# EAGLE schematic AMR3350 (EAGLE 9.3.0)
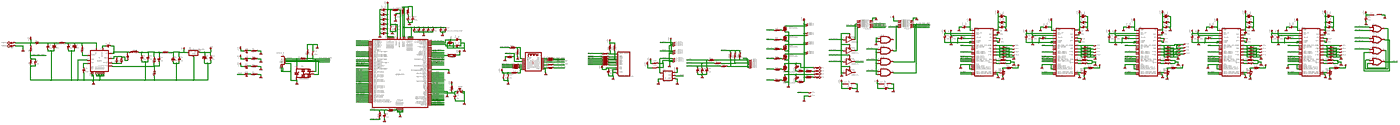
[diagram p0: schematic, sheet 1, overview]
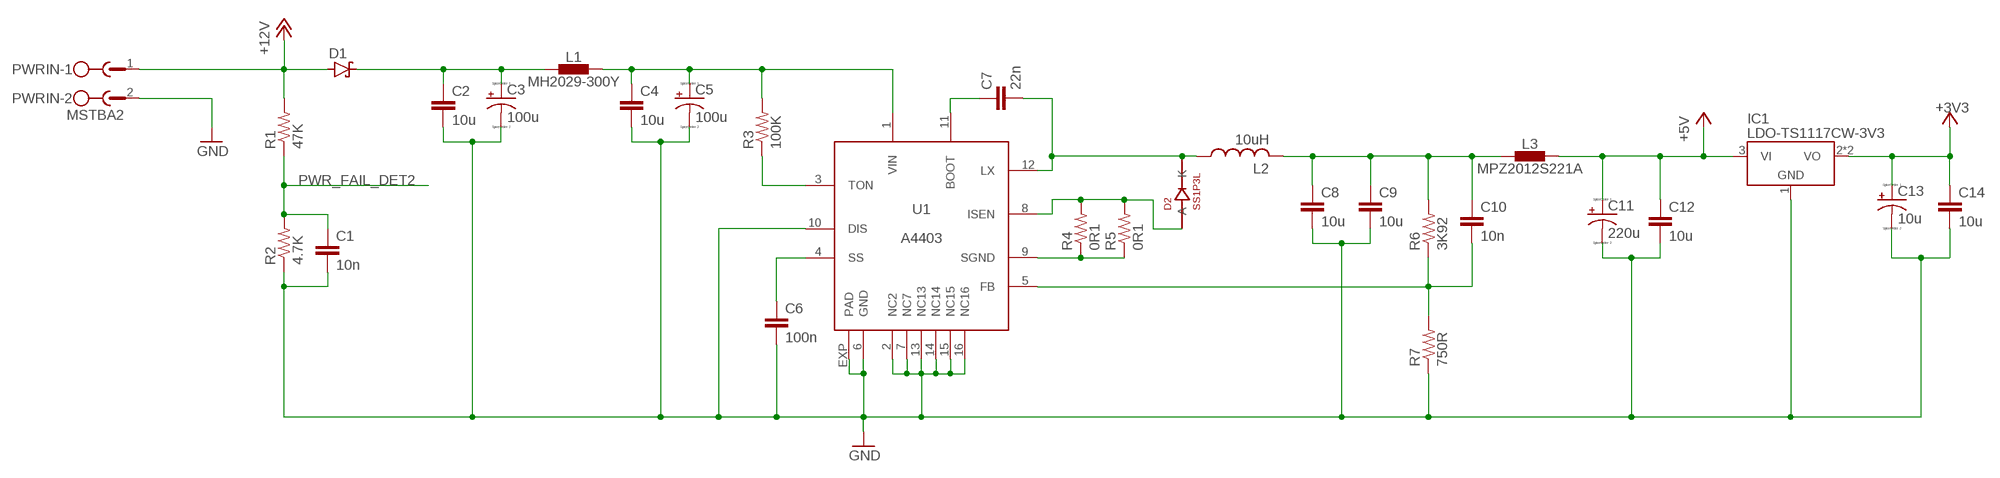
[diagram p1: schematic, sheet 1, part 1 of 8]
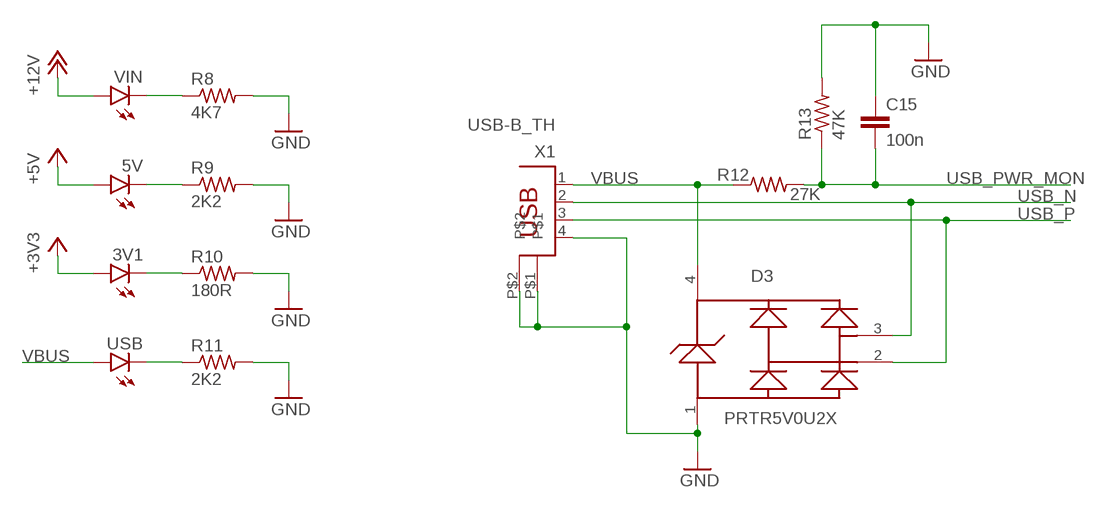
[diagram p2: schematic, sheet 1, part 2 of 8]
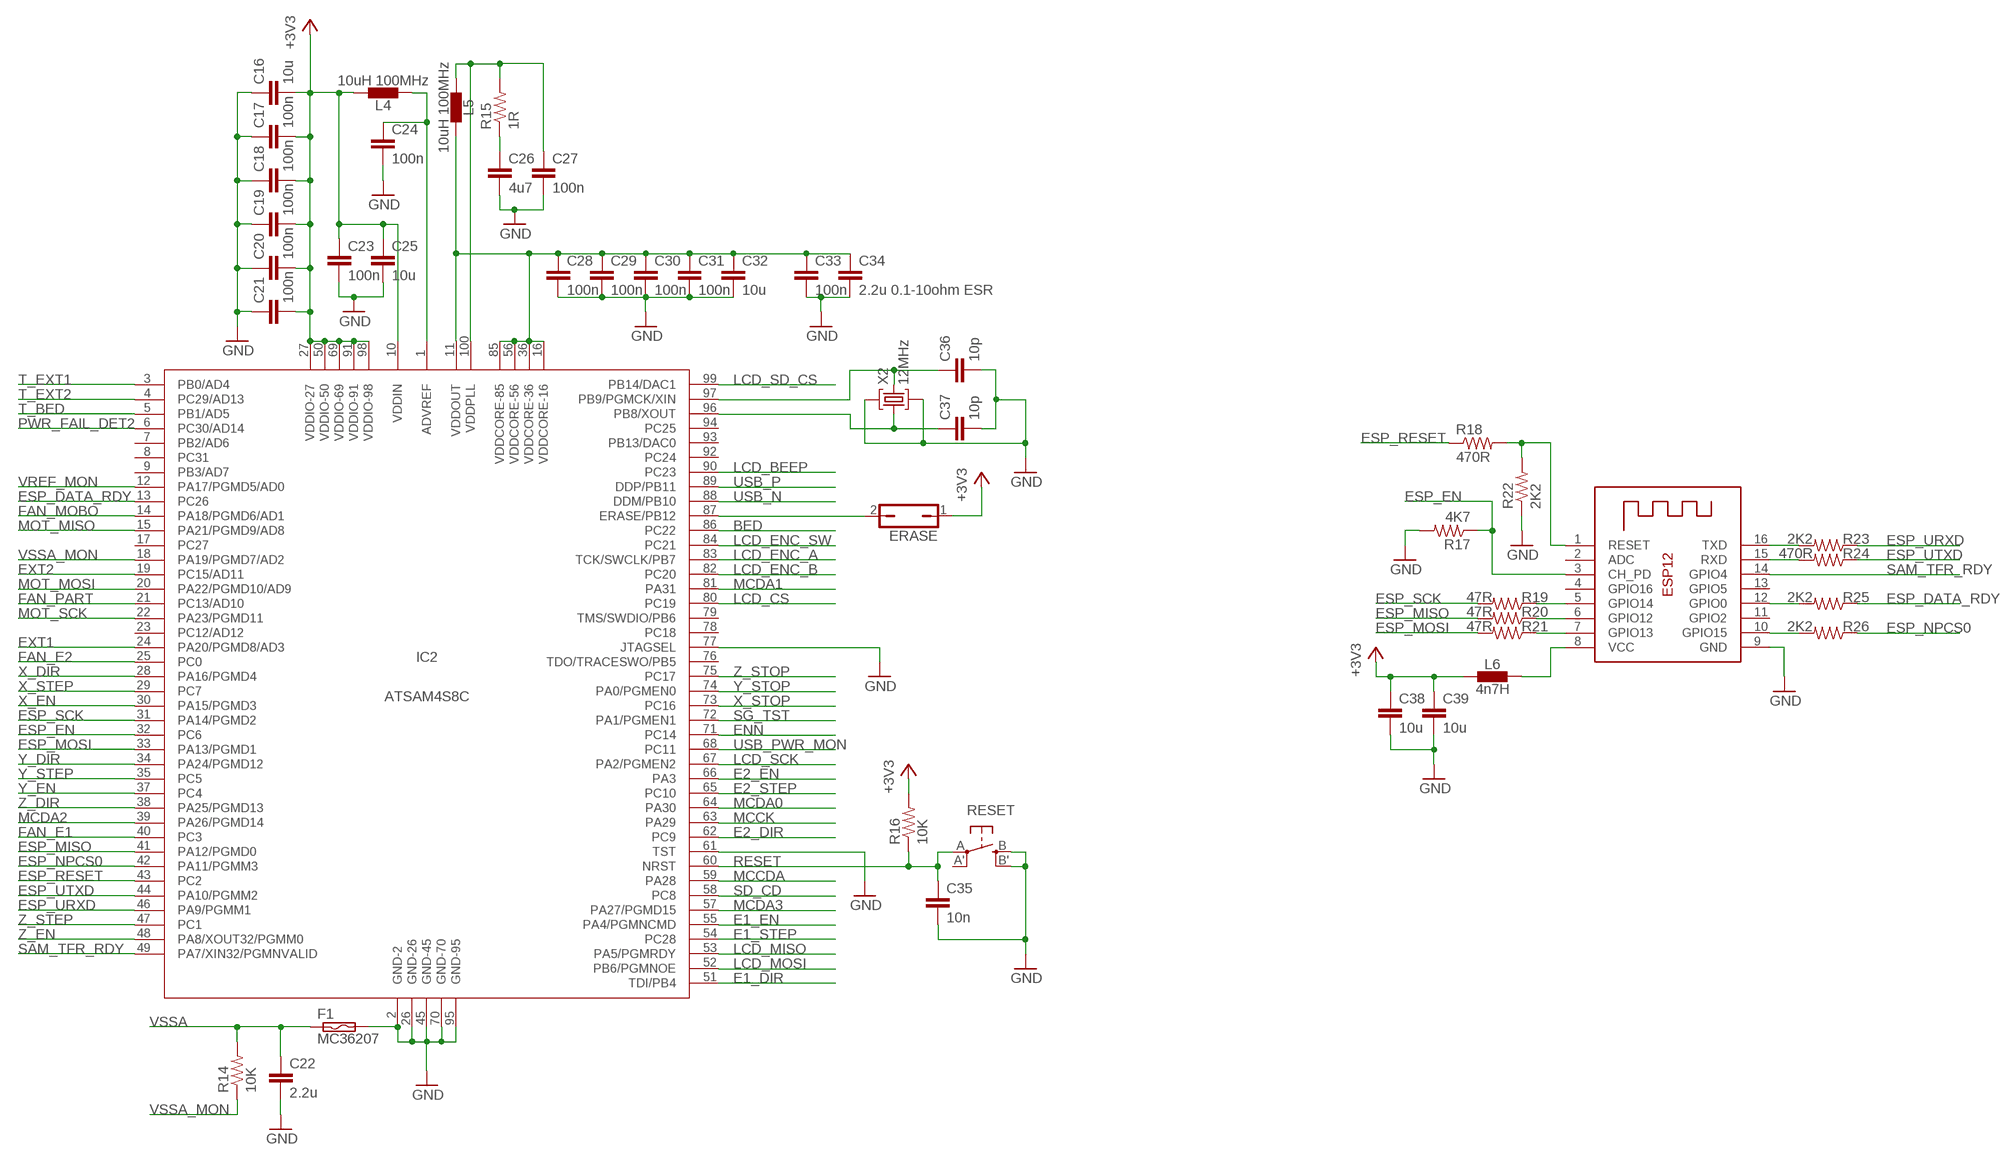
[diagram p3: schematic, sheet 1, part 3 of 8]
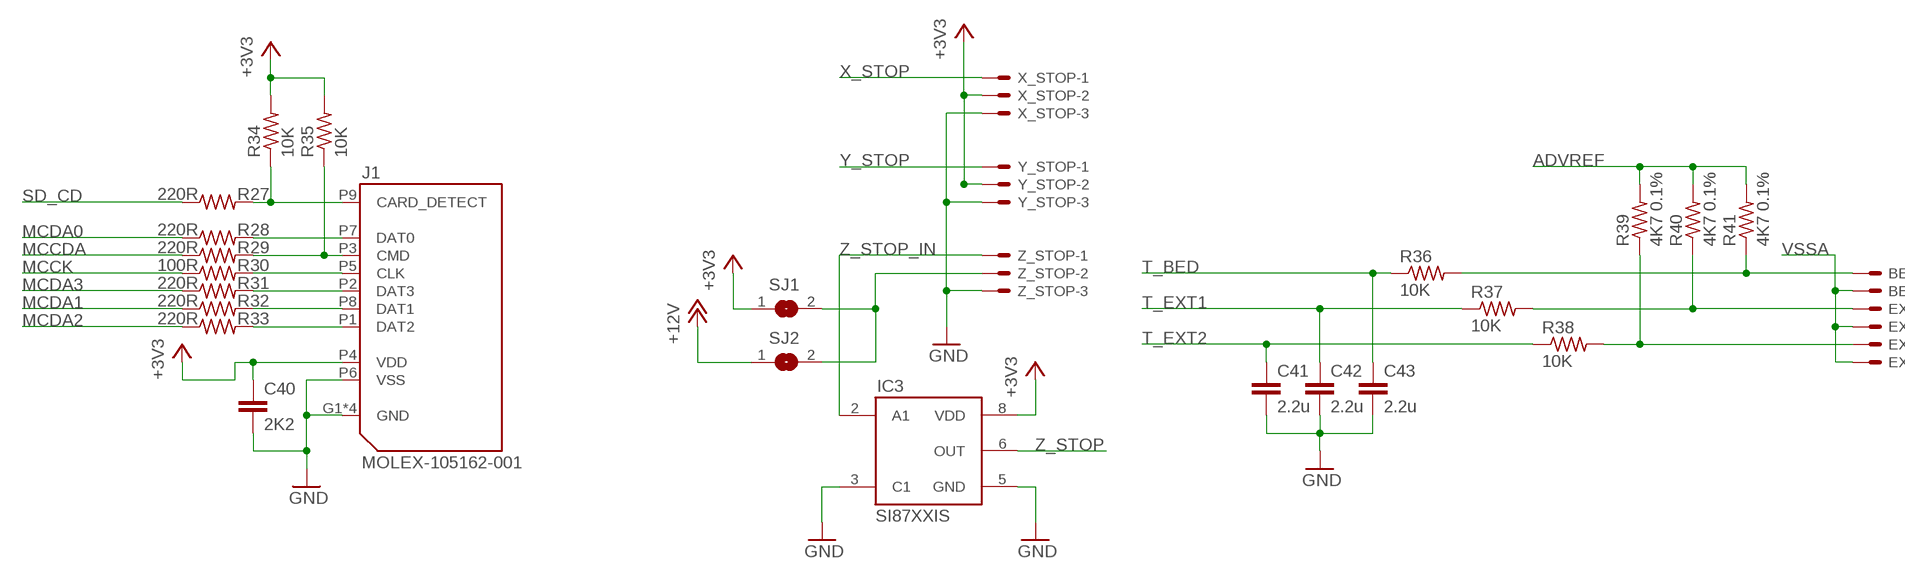
[diagram p4: schematic, sheet 1, part 4 of 8]
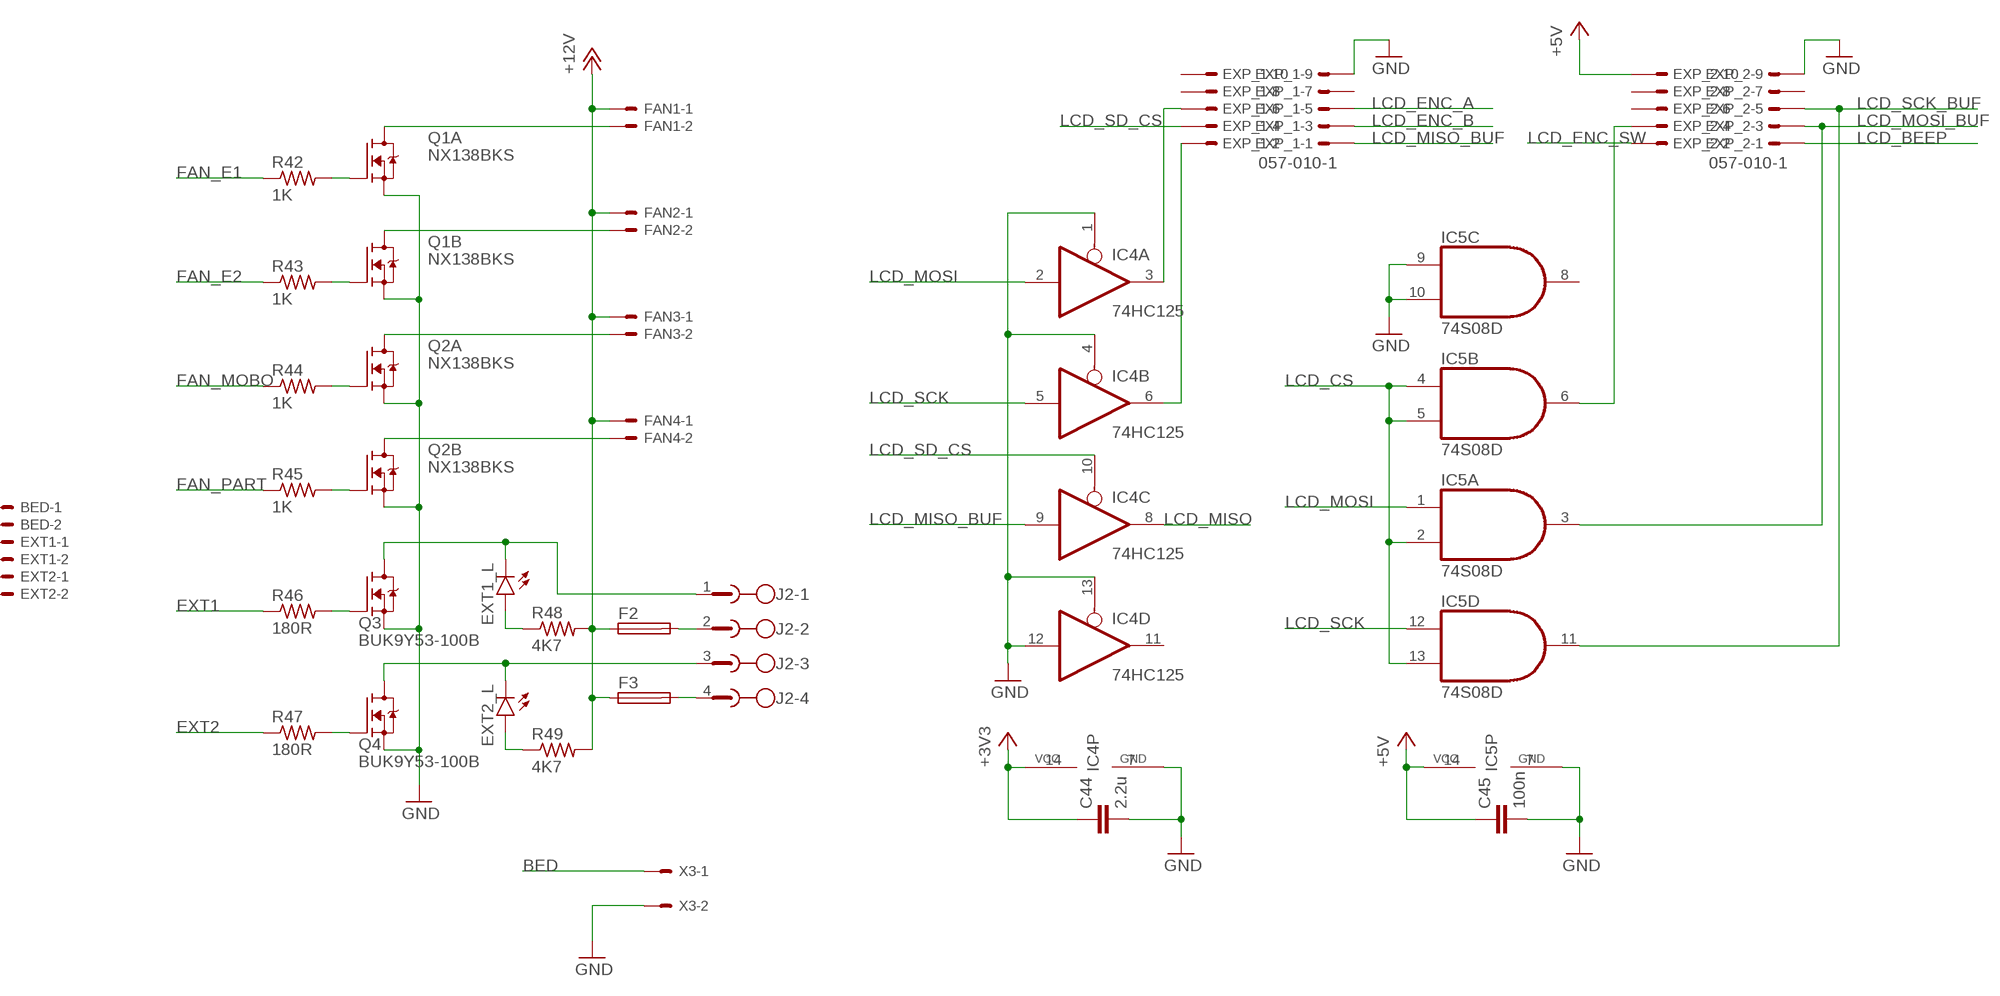
[diagram p5: schematic, sheet 1, part 5 of 8]
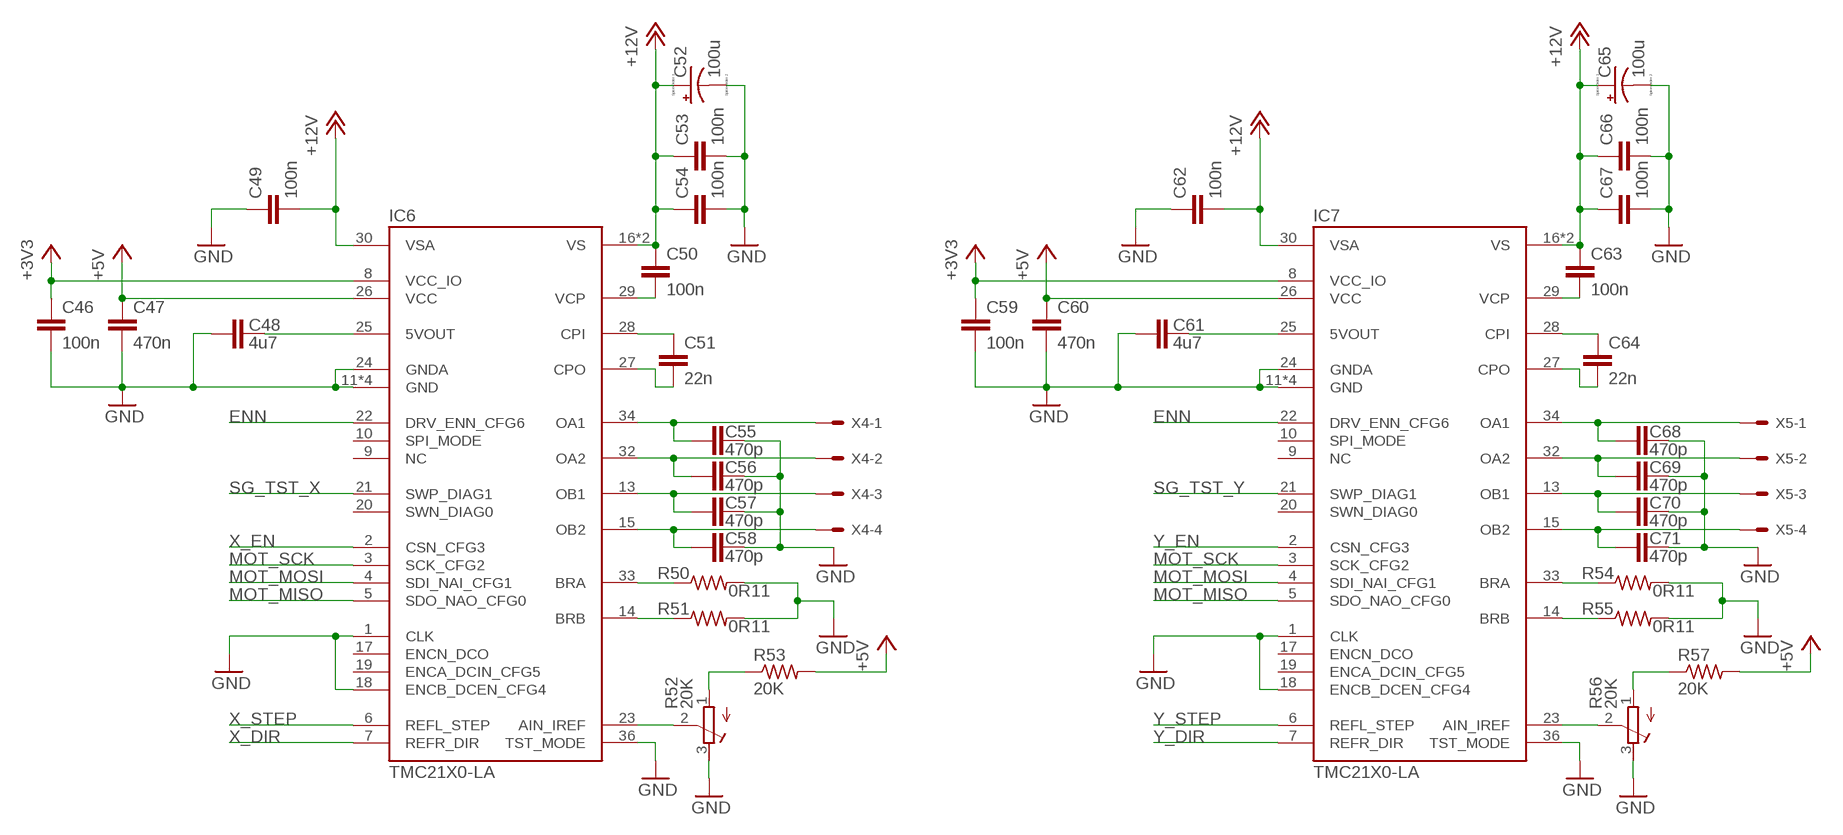
[diagram p6: schematic, sheet 1, part 6 of 8]
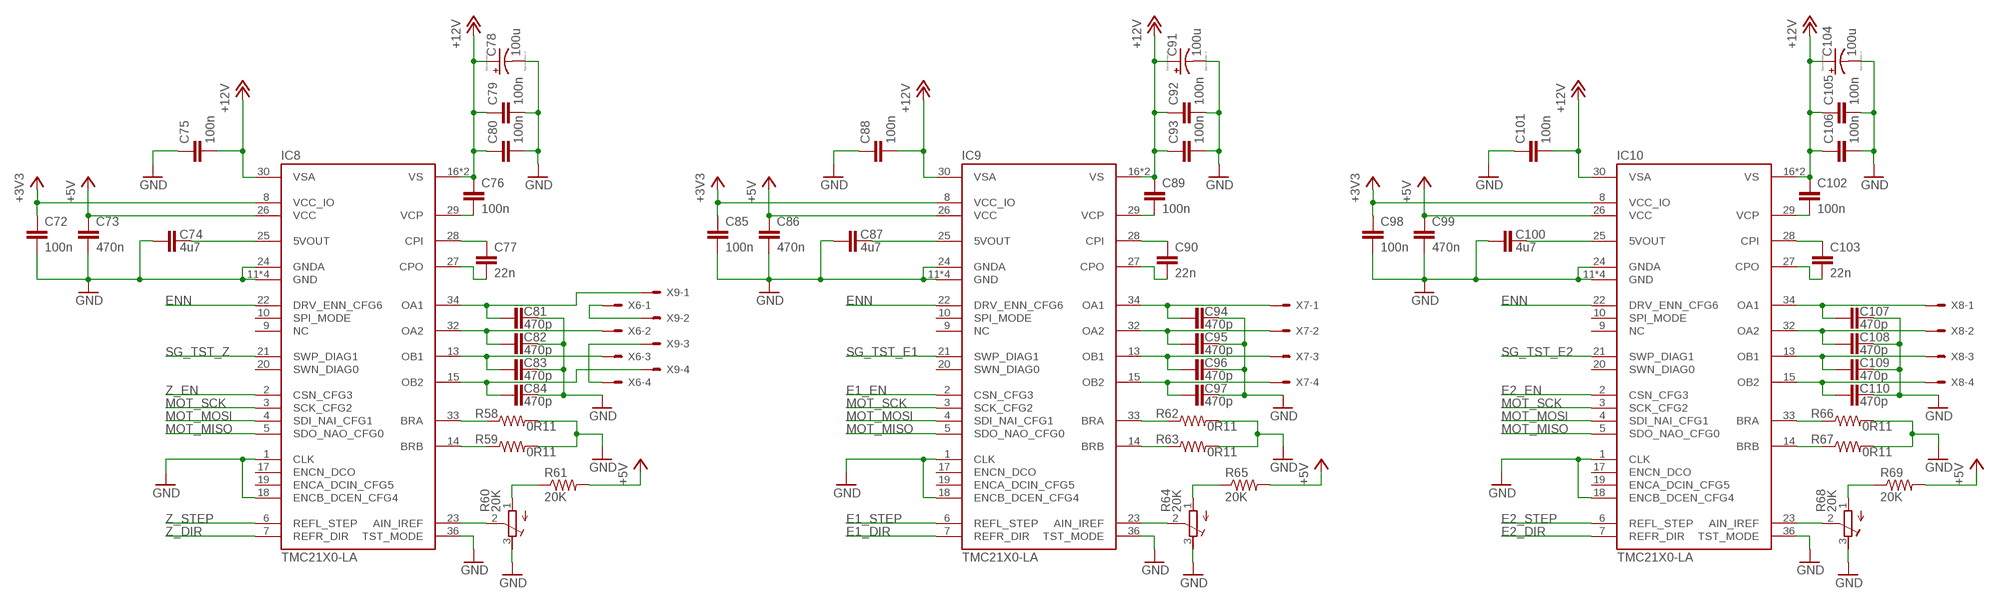
[diagram p7: schematic, sheet 1, part 7 of 8]
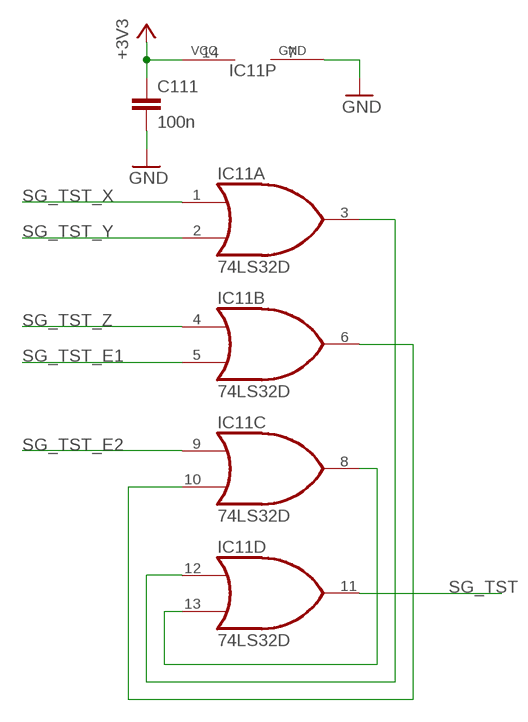
[diagram p8: schematic, sheet 1, part 8 of 8]

## Parts
3V1  LEDCHIPLED_0805  [CHIPLED_0805]
5V  LEDCHIPLED_0805  [CHIPLED_0805]
BED  KK-254-2  [MOLEX-KK-254-2]
C1  10n  C-EUC0603  [C0603]
C2  10u  C-EUC0603  [C0603]
C3  100u  CPOL-USD  [PANASONIC_D]
C4  10u  C-EUC0603  [C0603]
C5  100u  CPOL-USD  [PANASONIC_D]
C6  100n  C-EUC0603  [C0603]
C7  22n  C-EUC0603  [C0603]
C8  10u  C-EUC0603  [C0603]
C9  10u  C-EUC0603  [C0603]
C10  10n  C-EUC0603  [C0603]
C11  220u  CPOL-USD  [PANASONIC_D]
C12  10u  C-EUC0603  [C0603]
C13  10u  CPOL-USD  [PANASONIC_D]
C14  10u  C-EUC0603  [C0603]
C15  100n  C-EUC0603  [C0603]
C16  10u  C-EUC0805  [C0805]
C17  100n  C-EUC0603  [C0603]
C18  100n  C-EUC0603  [C0603]
C19  100n  C-EUC0603  [C0603]
C20  100n  C-EUC0603  [C0603]
C21  100n  C-EUC0603  [C0603]
C22  2.2u  C-EUC0603  [C0603]
C23  100n  C-EUC0603  [C0603]
C24  100n  C-EUC0603  [C0603]
C25  10u  C-EUC0603  [C0603]
C26  4u7  C-EUC0603  [C0603]
C27  100n  C-EUC0603  [C0603]
C28  100n  C-EUC0603  [C0603]
C29  100n  C-EUC0603  [C0603]
C30  100n  C-EUC0603  [C0603]
C31  100n  C-EUC0603  [C0603]
C32  10u  C-EUC0805  [C0805]
C33  100n  C-EUC0603  [C0603]
C34  2.2u 0.1-10ohm ESR  C-EUC0603  [C0603]
C35  10n  C-EUC0603  [C0603]
C36  10p  C-EUC0603  [C0603]
C37  10p  C-EUC0603  [C0603]
C38  10u  C-EUC0603  [C0603]
C39  10u  C-EUC0603  [C0603]
C40  2K2  C-EUC0603  [C0603]
C41  2.2u  C-EUC0603  [C0603]
C42  2.2u  C-EUC0603  [C0603]
C43  2.2u  C-EUC0603  [C0603]
C44  2.2u  C-EUC0603  [C0603]
C45  100n  C-EUC0603  [C0603]
C46  100n  C-EUC0603  [C0603]
C47  470n  C-EUC0603  [C0603]
C48  4u7  C-EUC0603  [C0603]
C49  100n  C-EUC0603  [C0603]
C50  100n  C-EUC0603  [C0603]
C51  22n  C-EUC0603  [C0603]
C52  100u  CPOL-USD  [PANASONIC_D]
C53  100n  C-EUC0603  [C0603]
C54  100n  C-EUC0603  [C0603]
C55  470p  C-EUC0402  [C0402]
C56  470p  C-EUC0402  [C0402]
C57  470p  C-EUC0402  [C0402]
C58  470p  C-EUC0402  [C0402]
C59  100n  C-EUC0603  [C0603]
C60  470n  C-EUC0603  [C0603]
C61  4u7  C-EUC0603  [C0603]
C62  100n  C-EUC0603  [C0603]
C63  100n  C-EUC0603  [C0603]
C64  22n  C-EUC0603  [C0603]
C65  100u  CPOL-USD  [PANASONIC_D]
C66  100n  C-EUC0603  [C0603]
C67  100n  C-EUC0603  [C0603]
C68  470p  C-EUC0402  [C0402]
C69  470p  C-EUC0402  [C0402]
C70  470p  C-EUC0402  [C0402]
C71  470p  C-EUC0402  [C0402]
C72  100n  C-EUC0603  [C0603]
C73  470n  C-EUC0603  [C0603]
C74  4u7  C-EUC0603  [C0603]
C75  100n  C-EUC0603  [C0603]
C76  100n  C-EUC0603  [C0603]
C77  22n  C-EUC0603  [C0603]
C78  100u  CPOL-USD  [PANASONIC_D]
C79  100n  C-EUC0603  [C0603]
C80  100n  C-EUC0603  [C0603]
C81  470p  C-EUC0402  [C0402]
C82  470p  C-EUC0402  [C0402]
C83  470p  C-EUC0402  [C0402]
C84  470p  C-EUC0402  [C0402]
C85  100n  C-EUC0603  [C0603]
C86  470n  C-EUC0603  [C0603]
C87  4u7  C-EUC0603  [C0603]
C88  100n  C-EUC0603  [C0603]
C89  100n  C-EUC0603  [C0603]
C90  22n  C-EUC0603  [C0603]
C91  100u  CPOL-USD  [PANASONIC_D]
C92  100n  C-EUC0603  [C0603]
C93  100n  C-EUC0603  [C0603]
C94  470p  C-EUC0402  [C0402]
C95  470p  C-EUC0402  [C0402]
C96  470p  C-EUC0402  [C0402]
C97  470p  C-EUC0402  [C0402]
C98  100n  C-EUC0603  [C0603]
C99  470n  C-EUC0603  [C0603]
C100  4u7  C-EUC0603  [C0603]
C101  100n  C-EUC0603  [C0603]
C102  100n  C-EUC0603  [C0603]
C103  22n  C-EUC0603  [C0603]
C104  100u  CPOL-USD  [PANASONIC_D]
C105  100n  C-EUC0603  [C0603]
C106  100n  C-EUC0603  [C0603]
C107  470p  C-EUC0402  [C0402]
C108  470p  C-EUC0402  [C0402]
C109  470p  C-EUC0402  [C0402]
C110  470p  C-EUC0402  [C0402]
C111  100n  C-EUC0603  [C0603]
D1  SCHOTTKY-DIODESMD  [SMB]
D2  SS1P3L  0025_SS1P3L-M3/84A  [DO220AAL]
D3  PRTR5V0U2XB  [SOT143B]
ERASE  JP1Q  [JP1]
ESP1  ESP-12  [ESP-12]
EXP_1  057-010-1  [057-010-1]
EXP_2  057-010-1  [057-010-1]
EXT1  KK-254-2  [MOLEX-KK-254-2]
EXT1_L  LEDCHIPLED_0805  [CHIPLED_0805]
EXT2  KK-254-2  [MOLEX-KK-254-2]
EXT2_L  LEDCHIPLED_0805  [CHIPLED_0805]
F1  MC36207  [MC36207]
F2  19560  [19560]
F3  19560  [19560]
FAN1  KK-254-2  [MOLEX-KK-254-2]
FAN2  KK-254-2  [MOLEX-KK-254-2]
FAN3  KK-254-2  [MOLEX-KK-254-2]
FAN4  KK-254-2  [MOLEX-KK-254-2]
IC1  LDO-TS1117CW-3V3  [SOT223]
IC2  ATSAM4S8C  [LQFP100]
IC3  SI87XXIS  [SOIC08-FAIRCHILD]
IC4  74HC125  [SO14]
IC5  74S08D  [SO14]
IC6  TMC21X0-LA  [QFN36-PAD]
IC7  TMC21X0-LA  [QFN36-PAD]
IC8  TMC21X0-LA  [QFN36-PAD]
IC9  TMC21X0-LA  [QFN36-PAD]
IC10  TMC21X0-LA  [QFN36-PAD]
IC11  74LS32D  [SO14]
J1  MOLEX-105162-001  [MOLEX-105162]
J2  MSTBV4  [MSTBV4]
L1  MH2029-300Y  INDUCTOR-0805  [C0805]
L2  10uH  L-USSRR0604  [SRR0604]
L3  MPZ2012S221A  INDUCTOR-0805  [C0805]
L4  10uH 100MHz  INDUCTOR-0603  [C0603]
L5  10uH 100MHz  INDUCTOR-0603  [C0603]
L6  4n7H  INDUCTOR-0603  [C0603]
PWRIN  MSTBA2  [MSTBA2]
Q1  NX138BKS  [SOT363_PHILIPS]
Q2  NX138BKS  [SOT363_PHILIPS]
Q3  BUK9Y53-100B  [SOT-669]
Q4  BUK9Y53-100B  [SOT-669]
R1  47K  R-US_R0603  [R0603]
R2  4.7K  R-US_R0603  [R0603]
R3  100K  R-US_R0603  [R0603]
R4  0R1  R-US_R0603  [R0603]
R5  0R1  R-US_R0603  [R0603]
R6  3K92  R-US_R0603  [R0603]
R7  750R  R-US_R0603  [R0603]
R8  4K7  R-US_R0603  [R0603]
R9  2K2  R-US_R0603  [R0603]
R10  180R  R-US_R0603  [R0603]
R11  2K2  R-US_R0603  [R0603]
R12  27K  R-US_R0603  [R0603]
R13  47K  R-US_R0603  [R0603]
R14  10K  R-US_R0603  [R0603]
R15  1R  R-US_R0603  [R0603]
R16  10K  R-US_R0603  [R0603]
R17  4K7  R-US_R0603  [R0603]
R18  470R  R-US_R0603  [R0603]
R19  47R  R-US_R0603  [R0603]
R20  47R  R-US_R0603  [R0603]
R21  47R  R-US_R0603  [R0603]
R22  2K2  R-US_R0603  [R0603]
R23  2K2  R-US_R0603  [R0603]
R24  470R  R-US_R0603  [R0603]
R25  2K2  R-US_R0603  [R0603]
R26  2K2  R-US_R0603  [R0603]
R27  220R  R-US_R0603  [R0603]
R28  220R  R-US_R0603  [R0603]
R29  220R  R-US_R0603  [R0603]
R30  100R  R-US_R0603  [R0603]
R31  220R  R-US_R0603  [R0603]
R32  220R  R-US_R0603  [R0603]
R33  220R  R-US_R0603  [R0603]
R34  10K  R-US_R0603  [R0603]
R35  10K  R-US_R0603  [R0603]
R36  10K  R-US_R0603  [R0603]
R37  10K  R-US_R0603  [R0603]
R38  10K  R-US_R0603  [R0603]
R39  4K7 0.1%  R-US_R0603  [R0603]
R40  4K7 0.1%  R-US_R0603  [R0603]
R41  4K7 0.1%  R-US_R0603  [R0603]
R42  1K  R-US_R0603  [R0603]
R43  1K  R-US_R0603  [R0603]
R44  1K  R-US_R0603  [R0603]
R45  1K  R-US_R0603  [R0603]
R46  180R  R-US_R0603  [R0603]
R47  180R  R-US_R0603  [R0603]
R48  4K7  R-US_R0603  [R0603]
R49  4K7  R-US_R0603  [R0603]
R50  0R11  R-US_R1206  [R1206]
R51  0R11  R-US_R1206  [R1206]
R52  20K  R-TRIMM3103  [RTRIM3103]
R53  20K  R-US_R0603  [R0603]
R54  0R11  R-US_R1206  [R1206]
R55  0R11  R-US_R1206  [R1206]
R56  20K  R-TRIMM3103  [RTRIM3103]
R57  20K  R-US_R0603  [R0603]
R58  0R11  R-US_R1206  [R1206]
R59  0R11  R-US_R1206  [R1206]
R60  20K  R-TRIMM3103  [RTRIM3103]
R61  20K  R-US_R0603  [R0603]
R62  0R11  R-US_R1206  [R1206]
R63  0R11  R-US_R1206  [R1206]
R64  20K  R-TRIMM3103  [RTRIM3103]
R65  20K  R-US_R0603  [R0603]
R66  0R11  R-US_R1206  [R1206]
R67  0R11  R-US_R1206  [R1206]
R68  20K  R-TRIMM3103  [RTRIM3103]
R69  20K  R-US_R0603  [R0603]
RESET  EVQQ2  [EVQQ2]
SJ1  SJ  [SJ]
SJ2  SJ  [SJ]
U1  A4403  [QFN16-4X4]
USB  LEDCHIPLED_0805  [CHIPLED_0805]
VIN  LEDCHIPLED_0805  [CHIPLED_0805]
X1  USB-B_TH  PN61729  [PN61729]
X2  12MHz  CRYSTAL-4PIN  [5.0X3.2_KX-9A]
X3  KK-254-2  [MOLEX-KK-254-2]
X4  KK-254-4  [MOLEX-KK-254-4]
X5  KK-254-4  [MOLEX-KK-254-4]
X6  KK-254-4  [MOLEX-KK-254-4]
X7  KK-254-4  [MOLEX-KK-254-4]
X8  KK-254-4  [MOLEX-KK-254-4]
X9  KK-254-4  [MOLEX-KK-254-4]
X_STOP  KK-254-3  [MOLEX-KK-254-3]
Y_STOP  KK-254-3  [MOLEX-KK-254-3]
Z_STOP  KK-254-3  [MOLEX-KK-254-3]

## Nets
3V3_LED: 3V1.C R10.1
5V_E1: C87.1 IC9.25(5VOUT)
5V_E2: C100.1 IC10.25(5VOUT)
5V_LED: 5V.C R9.1
5V_X: C48.1 IC6.25(5VOUT)
5V_Y: C61.1 IC7.25(5VOUT)
5V_Z: C74.1 IC8.25(5VOUT)
24V_LED: R8.1 VIN.C
+3V3: 3V1.A C13.+ C14.1 C16.2 C17.2 C18.2 C19.2 C20.2 C21.2 C23.1 C25.1 C38.1 C39.1 C40.1 C44.1 C46.1 C59.1 C72.1 C85.1 C98.1 C111.1 ERASE.1 IC1.2(VO) IC1.4(VO) IC2.10(VDDIN) IC2.27(VDDIO-27) IC2.50(VDDIO-50) IC2.69(VDDIO-69) IC2.91(VDDIO-91) IC2.98(VDDIO-98) IC3.8(VDD) IC4.14(P:VCC) IC6.8(VCC_IO) IC7.8(VCC_IO) IC8.8(VCC_IO) IC9.8(VCC_IO) IC10.8(VCC_IO) IC11.14(P:VCC) J1.P4(VDD) L4.2 L6.1 R16.2 R34.2 R35.2 SJ1.1 X_STOP.2 Y_STOP.2
+5V: 5V.A C11.+ C12.1 C45.1 C47.1 C60.1 C73.1 C86.1 C99.1 EXP_2.10 IC1.3(VI) IC5.14(P:VCC) IC6.26(VCC) IC7.26(VCC) IC8.26(VCC) IC9.26(VCC) IC10.26(VCC) L3.2 R53.2 R57.2 R61.2 R65.2 R69.2
+12V: C49.2 C50.1 C52.+ C53.1 C54.1 C62.2 C63.1 C65.+ C66.1 C67.1 C75.2 C76.1 C78.+ C79.1 C80.1 C88.2 C89.1 C91.+ C92.1 C93.1 C101.2 C102.1 C104.+ C105.1 C106.1 D1.A F2.1 F3.1 FAN1.1 FAN2.1 FAN3.1 FAN4.1 IC6.16(VS) IC6.30(VSA) IC6.31(VS) IC7.16(VS) IC7.30(VSA) IC7.31(VS) IC8.16(VS) IC8.30(VSA) IC8.31(VS) IC9.16(VS) IC9.30(VSA) IC9.31(VS) IC10.16(VS) IC10.30(VSA) IC10.31(VS) PWRIN.1 R1.2 R48.2 R49.2 SJ2.1 VIN.A
A1_E1: C94.1 IC9.34(OA1) X7.1
A1_E2: C107.1 IC10.34(OA1) X8.1
A1_X: C55.1 IC6.34(OA1) X4.1
A1_Y: C68.1 IC7.34(OA1) X5.1
A1_Z: C81.1 IC8.34(OA1) X9.1
A2_E1: C95.1 IC9.32(OA2) X7.2
A2_E2: C108.1 IC10.32(OA2) X8.2
A2_X: C56.1 IC6.32(OA2) X4.2
A2_Y: C69.1 IC7.32(OA2) X5.2
A2_Z: C82.1 IC8.32(OA2) X6.2
ADVREF: C24.1 IC2.1(ADVREF) L4.1 R39.2 R40.2 R41.2
B1_E1: C96.1 IC9.13(OB1) X7.3
B1_E2: C109.1 IC10.13(OB1) X8.3
B1_X: C57.1 IC6.13(OB1) X4.3
B1_Y: C70.1 IC7.13(OB1) X5.3
B1_Z: C83.1 IC8.13(OB1) X6.3
B2_E1: C97.1 IC9.15(OB2) X7.4
B2_E2: C110.1 IC10.15(OB2) X8.4
B2_X: C58.1 IC6.15(OB2) X4.4
B2_Y: C71.1 IC7.15(OB2) X5.4
B2_Z: C84.1 IC8.15(OB2) X9.4
BED: IC2.86(PC22) X3.1
BED_L: EXT2_L.A R49.1
BOOT: C7.1 U1.11(BOOT)
BRA_E1: IC9.33(BRA) R62.1
BRA_E2: IC10.33(BRA) R66.1
BRA_X: IC6.33(BRA) R50.1
BRA_Y: IC7.33(BRA) R54.1
BRA_Z: IC8.33(BRA) R58.1
BRB_E1: IC9.14(BRB) R63.1
BRB_E2: IC10.14(BRB) R67.1
BRB_X: IC6.14(BRB) R51.1
BRB_Y: IC7.14(BRB) R55.1
BRB_Z: IC8.14(BRB) R59.1
CLK: J1.P5(CLK) R30.2
CMD: J1.P3(CMD) R29.2 R35.1
CPI_E1: C90.1 IC9.28(CPI)
CPI_E2: C103.1 IC10.28(CPI)
CPI_X: C51.1 IC6.28(CPI)
CPI_Y: C64.1 IC7.28(CPI)
CPI_Z: C77.1 IC8.28(CPI)
CPO_E1: C90.2 IC9.27(CPO)
CPO_E2: C103.2 IC10.27(CPO)
CPO_X: C51.2 IC6.27(CPO)
CPO_Y: C64.2 IC7.27(CPO)
CPO_Z: C77.2 IC8.27(CPO)
DAT0: J1.P7(DAT0) R28.2
DAT1: J1.P8(DAT1) R32.2
DAT2: J1.P1(DAT2) R33.2
DAT3: J1.P2(DAT3) R31.2
DET: J1.P9(CARD_DETECT) R27.2 R34.1
E1_DIR: IC2.51(TDI/PB4) IC9.7(REFR_DIR)
E1_EN: IC2.55(PA4/PGMNCMD) IC9.2(CSN_CFG3)
E1_STEP: IC2.54(PC28) IC9.6(REFL_STEP)
E2_DIR: IC2.62(PC9) IC10.7(REFR_DIR)
E2_EN: IC2.66(PA3) IC10.2(CSN_CFG3)
E2_STEP: IC2.65(PC10) IC10.6(REFL_STEP)
EDR_CONN: ESP1.12(GPIO0) R25.2
ENN: IC2.71(PC14) IC6.22(DRV_ENN_CFG6) IC7.22(DRV_ENN_CFG6) IC8.22(DRV_ENN_CFG6) IC9.22(DRV_ENN_CFG6) IC10.22(DRV_ENN_CFG6)
ERASE: ERASE.2 IC2.87(ERASE/PB12)
ESP_CS: ESP1.10(GPIO15) R26.2
ESP_DATA_RDY: IC2.13(PC26) R25.1
ESP_EN: ESP1.3(CH_PD) IC2.32(PC6) R17.1
ESP_MISO: IC2.41(PA12/PGMD0) R20.2
ESP_MOSI: IC2.33(PA13/PGMD1) R21.2
ESP_NPCS0: IC2.42(PA11/PGMM3) R26.1
ESP_RESET: IC2.43(PC2) R18.1
ESP_RST: ESP1.1(RESET) R18.2 R22.2
ESP_SCK: IC2.31(PA14/PGMD2) R19.2
ESP_URDX: ESP1.16(TXD) R23.2
ESP_URXD: IC2.46(PA9/PGMM1) R23.1
ESP_UTDX: ESP1.15(RXD) R24.2
ESP_UTXD: IC2.44(PA10/PGMM2) R24.1
ESP_VIN: ESP1.8(VCC) L6.2
EXT1: IC2.24(PA20/PGMD8/AD3) R46.1
EXT1_D: EXT1_L.C J2.1 Q3.EXP(D) Q3.MB(D)
EXT1_G: Q3.4(G) R46.2
EXT2: IC2.19(PC15/AD11) R47.1
EXT2_D: EXT2_L.C J2.3 Q4.EXP(D) Q4.MB(D)
EXT2_G: Q4.4(G) R47.2
EXT_L: EXT1_L.A R48.1
FAN1_D: FAN1.2 Q1.6(A:D)
FAN1_G: Q1.2(A:G) R42.2
FAN2_D: FAN2.2 Q1.3(B:D)
FAN2_G: Q1.5(B:G) R43.2
FAN3_D: FAN3.2 Q2.6(A:D)
FAN3_G: Q2.2(A:G) R44.2
FAN4_D: FAN4.2 Q2.3(B:D)
FAN4_G: Q2.5(B:G) R45.2
FAN_E1: IC2.40(PC3) R42.1
FAN_E2: IC2.25(PC0) R43.1
FAN_MOBO: IC2.14(PA18/PGMD6/AD1) R44.1
FAN_PART: IC2.21(PC13/AD10) R45.1
FB: C10.2 R6.1 R7.2 U1.5(FB)
GND: C1.2 C2.2 C3.- C4.2 C5.- C6.2 C8.2 C9.2 C11.- C12.2 C13.- C14.2 C15.1 C16.1 C17.1 C18.1 C19.1 C20.1 C21.1 C22.2 C23.2 C24.2 C25.2 C26.2 C27.2 C28.2 C29.2 C30.2 C31.2 C32.2 C33.2 C34.2 C35.2 C36.2 C37.2 C38.2 C39.2 C40.2 C41.2 C42.2 C43.2 C44.2 C45.2 C46.2 C47.2 C48.2 C49.1 C52.- C53.2 C54.2 C55.2 C56.2 C57.2 C58.2 C59.2 C60.2 C61.2 C62.1 C65.- C66.2 C67.2 C68.2 C69.2 C70.2 C71.2 C72.2 C73.2 C74.2 C75.1 C78.- C79.2 C80.2 C81.2 C82.2 C83.2 C84.2 C85.2 C86.2 C87.2 C88.1 C91.- C92.2 C93.2 C94.2 C95.2 C96.2 C97.2 C98.2 C99.2 C100.2 C101.1 C104.- C105.2 C106.2 C107.2 C108.2 C109.2 C110.2 C111.2 D3.1 ESP1.9(GND) EXP_1.9 EXP_2.9 F1.2 IC1.1(GND) IC2.2(GND-2) IC2.26(GND-26) IC2.45(GND-45) IC2.61(TST) IC2.70(GND-70) IC2.77(JTAGSEL) IC2.95(GND-95) IC3.3(C1) IC3.5(GND) IC4.1(A:OE) IC4.4(B:OE) IC4.7(P:GND) IC4.12(D:I) IC4.13(D:OE) IC5.7(P:GND) IC5.9(C:I0) IC5.10(C:I1) IC6.1(CLK) IC6.11(GND) IC6.12(GND) IC6.18(ENCB_DCEN_CFG4) IC6.24(GNDA) IC6.35(GND) IC6.36(TST_MODE) IC6.TP(GND) IC7.1(CLK) IC7.11(GND) IC7.12(GND) IC7.18(ENCB_DCEN_CFG4) IC7.24(GNDA) IC7.35(GND) IC7.36(TST_MODE) IC7.TP(GND) IC8.1(CLK) IC8.11(GND) IC8.12(GND) IC8.18(ENCB_DCEN_CFG4) IC8.24(GNDA) IC8.35(GND) IC8.36(TST_MODE) IC8.TP(GND) IC9.1(CLK) IC9.11(GND) IC9.12(GND) IC9.18(ENCB_DCEN_CFG4) IC9.24(GNDA) IC9.35(GND) IC9.36(TST_MODE) IC9.TP(GND) IC10.1(CLK) IC10.11(GND) IC10.12(GND) IC10.18(ENCB_DCEN_CFG4) IC10.24(GNDA) IC10.35(GND) IC10.36(TST_MODE) IC10.TP(GND) IC11.7(P:GND) J1.G1(GND) J1.G2(GND) J1.G3(GND) J1.G4(GND) J1.P6(VSS) PWRIN.2 Q1.1(A:S) Q1.4(B:S) Q2.1(A:S) Q2.4(B:S) Q3.1(S) Q3.2(S) Q3.3(S) Q4.1(S) Q4.2(S) Q4.3(S) R2.1 R7.1 R8.2 R9.2 R10.2 R11.2 R13.2 R17.2 R22.1 R50.2 R51.2 R52.3(E) R54.2 R55.2 R56.3(E) R58.2 R59.2 R60.3(E) R62.2 R63.2 R64.3(E) R66.2 R67.2 R68.3(E) RESET.B'(S1) RESET.B(S) U1.2(NC2) U1.6(GND) U1.7(NC7) U1.10(DIS) U1.13(NC13) U1.14(NC14) U1.15(NC15) U1.16(NC16) U1.EXP(PAD) X1.4 X1.P$1 X1.P$2 X2.2 X2.4 X3.2 X_STOP.3 Y_STOP.3 Z_STOP.3
IREF_E1: IC9.23(AIN_IREF) R64.2(S)
IREF_E2: IC10.23(AIN_IREF) R68.2(S)
IREF_X: IC6.23(AIN_IREF) R52.2(S)
IREF_Y: IC7.23(AIN_IREF) R56.2(S)
IREF_Z: IC8.23(AIN_IREF) R60.2(S)
ISEN: D2.P$2(A) R4.2 R5.2 U1.8(ISEN)
LCD_BEEP: EXP_2.1 IC2.90(PC23)
LCD_CS: IC2.80(PC19) IC5.2(A:I1) IC5.4(B:I0) IC5.5(B:I1) IC5.13(D:I1)
LCD_CS_BUF: EXP_2.4 IC5.6(B:O)
LCD_ENC_A: EXP_1.5 IC2.83(TCK/SWCLK/PB7)
LCD_ENC_B: EXP_1.3 IC2.82(PC20)
LCD_ENC_SW: EXP_2.2 IC2.84(PC21)
LCD_MISO: IC2.53(PA5/PGMRDY) IC4.8(C:O)
LCD_MISO_BUF: EXP_1.1 IC4.9(C:I)
LCD_MOSI: IC2.52(PB6/PGMNOE) IC4.2(A:I) IC5.1(A:I0)
LCD_MOSI_BUF: EXP_2.3 IC5.3(A:O)
LCD_SCK: IC2.67(PA2/PGMEN2) IC4.5(B:I) IC5.12(D:I0)
LCD_SCK_BUF: EXP_2.5 IC5.11(D:O)
LCD_SD_CS: EXP_1.4 IC2.99(PB14/DAC1) IC4.10(C:OE)
LX: C7.2 D2.P$1(K) L2.P$1 U1.12(LX)
MCCDA: IC2.59(PA28) R29.1
MCCK: IC2.63(PA29) R30.1
MCDA0: IC2.64(PA30) R28.1
MCDA1: IC2.81(PA31) R32.1
MCDA2: IC2.39(PA26/PGMD14) R33.1
MCDA3: IC2.57(PA27/PGMD15) R31.1
MISO: ESP1.6(GPIO12) R20.1
MOSI: ESP1.7(GPIO13) R21.1
MOT_MISO: IC2.15(PA21/PGMD9/AD8) IC6.5(SDO_NAO_CFG0) IC7.5(SDO_NAO_CFG0) IC8.5(SDO_NAO_CFG0) IC9.5(SDO_NAO_CFG0) IC10.5(SDO_NAO_CFG0)
MOT_MOSI: IC2.20(PA22/PGMD10/AD9) IC6.4(SDI_NAI_CFG1) IC7.4(SDI_NAI_CFG1) IC8.4(SDI_NAI_CFG1) IC9.4(SDI_NAI_CFG1) IC10.4(SDI_NAI_CFG1)
MOT_SCK: IC2.22(PA23/PGMD11) IC6.3(SCK_CFG2) IC7.3(SCK_CFG2) IC8.3(SCK_CFG2) IC9.3(SCK_CFG2) IC10.3(SCK_CFG2)
N$1: F2.2 J2.2
N$2: F3.2 J2.4
N$3: X6.1 X9.2
N$4: X6.4 X9.3
N$5: IC11.6(B:O) IC11.10(C:I1)
N$7: IC11.3(A:O) IC11.12(D:I0)
N$8: IC11.8(C:O) IC11.13(D:I1)
N$55: C26.1 R15.1
PWR_FAIL_DET2: C1.1 IC2.6(PC30/AD14) R1.1 R2.2
REFIN_E1: R64.1(A) R65.1
REFIN_E2: R68.1(A) R69.1
REFIN_X: R52.1(A) R53.1
REFIN_Y: R56.1(A) R57.1
REFIN_Z: R60.1(A) R61.1
RESET: C35.1 IC2.60(NRST) R16.1 RESET.A(P)
SAM_TFR_RDY: ESP1.14(GPIO4) IC2.49(PA7/XIN32/PGMNVALID)
SD_CD: IC2.58(PC8) R27.1
SD_MOSI_BUF: EXP_1.6 IC4.3(A:O)
SD_SCK_BUF: EXP_1.2 IC4.6(B:O)
SG_TST: IC2.72(PA1/PGMEN1) IC11.11(D:O)
SG_TST_E1: IC9.21(SWP_DIAG1) IC11.5(B:I1)
SG_TST_E2: IC10.21(SWP_DIAG1) IC11.9(C:I0)
SG_TST_X: IC6.21(SWP_DIAG1) IC11.1(A:I0)
SG_TST_Y: IC7.21(SWP_DIAG1) IC11.2(A:I1)
SG_TST_Z: IC8.21(SWP_DIAG1) IC11.4(B:I0)
SGND: R4.1 R5.1 U1.9(SGND)
SPCK: ESP1.5(GPIO14) R19.1
SS: C6.1 U1.4(SS)
T_BED: C43.1 IC2.5(PB1/AD5) R36.1
T_BED_IN: BED.1 R36.2 R41.1
T_EXT1: C42.1 IC2.3(PB0/AD4) R37.1
T_EXT2: C41.1 IC2.4(PC29/AD13) R38.1
T_EXT_IN: EXT1.1 R37.2 R40.1
T_EXT_IN1: EXT2.1 R38.2 R39.1
TON: R3.1 U1.3(TON)
USB_LED: R11.1 USB.C
USB_N [diff]: D3.3 IC2.88(DDM/PB10) X1.2
USB_P [diff]: D3.2 IC2.89(DDP/PB11) X1.3
USB_PWR_MON: C15.2 IC2.68(PC11) R12.2 R13.1
VBUS: D3.4 R12.1 USB.A X1.1
VCP_E1: C89.2 IC9.29(VCP)
VCP_E2: C102.2 IC10.29(VCP)
VCP_X: C50.2 IC6.29(VCP)
VCP_Y: C63.2 IC7.29(VCP)
VCP_Z: C76.2 IC8.29(VCP)
VDDOUT: C28.1 C29.1 C30.1 C31.1 C32.1 C33.1 C34.1 IC2.11(VDDOUT) IC2.16(VDDCORE-16) IC2.36(VDDCORE-36) IC2.56(VDDCORE-56) IC2.85(VDDCORE-85) L5.2
VDDPLL: C27.1 IC2.100(VDDPLL) L5.1 R15.2
VIN: C2.1 C3.+ D1.C L1.1
VIN_F: C4.1 C5.+ L1.2 R3.2 U1.1(VIN)
VOUT: C8.1 C9.1 C10.1 L2.P$2 L3.1 R6.2
VREF_MON: IC2.12(PA17/PGMD5/AD0)
VSSA: BED.2 C22.1 EXT1.2 EXT2.2 F1.1 R14.2
VSSA_MON: IC2.18(PA19/PGMD7/AD2) R14.1
X_DIR: IC2.28(PA16/PGMD4) IC6.7(REFR_DIR)
X_EN: IC2.30(PA15/PGMD3) IC6.2(CSN_CFG3)
X_STEP: IC2.29(PC7) IC6.6(REFL_STEP)
X_STOP: IC2.73(PC16) X_STOP.1
XIN: C36.1 IC2.97(PB9/PGMCK/XIN) X2.3
XOUT: C37.1 IC2.96(PB8/XOUT) X2.1
Y_DIR: IC2.34(PA24/PGMD12) IC7.7(REFR_DIR)
Y_EN: IC2.37(PC4) IC7.2(CSN_CFG3)
Y_STEP: IC2.35(PC5) IC7.6(REFL_STEP)
Y_STOP: IC2.74(PA0/PGMEN0) Y_STOP.1
Z_DIR: IC2.38(PA25/PGMD13) IC8.7(REFR_DIR)
Z_EN: IC2.48(PA8/XOUT32/PGMM0) IC8.2(CSN_CFG3)
Z_STEP: IC2.47(PC1) IC8.6(REFL_STEP)
Z_STOP: IC2.75(PC17) IC3.6(OUT)
Z_STOP_IN: IC3.2(A1) Z_STOP.1
ZVSEL: SJ1.2 SJ2.2 Z_STOP.2
Unconnected: ESP1.2(ADC) ESP1.4(GPIO16) ESP1.11(GPIO2) ESP1.13(GPIO5) EXP_1.7 EXP_1.8 EXP_1.10 EXP_2.6 EXP_2.7 EXP_2.8 IC2.7(PB2/AD6) IC2.8(PC31) IC2.9(PB3/AD7) IC2.17(PC27) IC2.23(PC12/AD12) IC2.76(TDO/TRACESWO/PB5) IC2.78(PC18) IC2.79(TMS/SWDIO/PB6) IC2.92(PC24) IC2.93(PB13/DAC0) IC2.94(PC25) IC4.11(D:O) IC5.8(C:O) IC6.9(NC) IC6.10(SPI_MODE) IC6.17(ENCN_DCO) IC6.19(ENCA_DCIN_CFG5) IC6.20(SWN_DIAG0) IC7.9(NC) IC7.10(SPI_MODE) IC7.17(ENCN_DCO) IC7.19(ENCA_DCIN_CFG5) IC7.20(SWN_DIAG0) IC8.9(NC) IC8.10(SPI_MODE) IC8.17(ENCN_DCO) IC8.19(ENCA_DCIN_CFG5) IC8.20(SWN_DIAG0) IC9.9(NC) IC9.10(SPI_MODE) IC9.17(ENCN_DCO) IC9.19(ENCA_DCIN_CFG5) IC9.20(SWN_DIAG0) IC10.9(NC) IC10.10(SPI_MODE) IC10.17(ENCN_DCO) IC10.19(ENCA_DCIN_CFG5) IC10.20(SWN_DIAG0) RESET.A'(P1)

## Library data of the parts
3V1 5V EXT1_L EXT2_L USB VIN = led:LED: LED OSRAM: - CHIPLED LG R971, LG N971, LY N971, LG Q971, LY Q971, LO R971, LY R971 LH N974, LH R974 LS Q976, LO Q976, LY Q976 LO Q996 - Hyper CHIPLED LW Q18S LB Q993, LB Q99A, LB R99A - SideLED LS A670, LO A670, LY A670, LG A670, LP A670 LB A673, LV A673, LT A673, LW A673 LH A674 LY A675 LS A676, LA A676, LO A676, LY A676, LW A676 LS A679, LY A679, LG A679 - Hyper Micro SIDELED® LS Y876, LA Y876, LO Y876, LY Y876 LT Y87S - SmartLED LW L88C, LW L88S LB L89C, LB L89S, LG L890 LS L89K, LO L89K, LY L89K LS L896, LA L896, LO L896, LY L896 - TOPLED LS T670, LO T670, LY T670, LG T670, LP T670 LSG T670, LSP T670, LSY T670, LOP T670, LYG T670 LG T671, LOG T671, LSG T671 LB T673, LV T673, LT T673, LW T673 LH T674 LS T676, LA T676, LO T676, LY T676, LB T676, LH T676, LSB T676, LW T676 LB T67C, LV T67C, LT T67C, LS T67K, LO T67K, LY T67K, LW E67C LS E67B, LA E67B, LO E67B, LY E67B, LB E67C, LV E67C, LT E67C LW T67C LS T679, LY T679, LG T679 LS T770, LO T770, LY T770, LG T770, LP T770 LB T773, LV T773, LT T773, LW T773 LH T774 LS E675, LA E675, LY E675, LS T675 LS T776, LA T776, LO T776, LY T776, LB T776 LHGB T686 LT T68C, LB T68C - Hyper Mini TOPLED® LB M676 - Mini TOPLED Santana® LG M470 LS M47K, LO M47K, LY M47K Source: http://www.osram.convergy.de LUXEON: - LUMILED® LXK2-PW12-R00, LXK2-PW12-S00, LXK2-PW14-U00, LXK2-PW14-V00 LXK2-PM12-R00, LXK2-PM12-S00, LXK2-PM14-U00 LXK2-PE12-Q00, LXK2-PE12-R00, LXK2-PE12-S00, LXK2-PE14-T00, LXK2-PE14-U00 LXK2-PB12-K00, LXK2-PB12-L00, LXK2-PB12-M00, LXK2-PB14-N00, LXK2-PB14-P00, LXK2-PB14-Q00 LXK2-PR12-L00, LXK2-PR12-M00, LXK2-PR14-Q00, LXK2-PR14-R00 LXK2-PD12-Q00, LXK2-PD12-R00, LXK2-PD12-S00 LXK2-PH12-R00, LXK2-PH12-S00 LXK2-PL12-P00, LXK2-PL12-Q00, LXK2-PL12-R00 Source: www.luxeon.com KINGBRIGHT: KA-3528ASYC Source: www.kingbright.com
BED EXT1 EXT2 FAN1-FAN4 X3 = con-other:KK-254-2
C1 C2 C4 C6-C10 C12 C14-C51 C53-C64 C66-C77 C79-C90 C92-C103 C105-C110 = resistor:C-EU: CAPACITOR, European symbol
C3 C5 C11 C13 C52 C65 C78 C91 C104 = resistor:CPOL-US: POLARIZED CAPACITOR, American symbol
C111 = rcl:C-EU: CAPACITOR, European symbol; SPICEPREFIX: C
D1 = diode:SCHOTTKY-DIODE: Schottky Diode
D2 = Diodi:0025_SS1P3L-M3/84A: 1A 30V Schottky Barrier Rectifiers -SS1P3L-M3/84A; CASE: SMP; MONTHLY_USAGE: _____; PART_NUMBER: SS1P3L-M3/84A; PRICE: _____; SUPPLIER: _____; TYPE: Diodi
D3 = Arduino:PRTR5V0U2X
ERASE = jumper:JP1Q: JUMPER
ESP1 = adafruit:ESP-12
EXP_1 EXP_2 = con-panduit:057-010-: CONNECTOR 10-pin series 057 contact pc board low profile headers; OC_FARNELL: unknown; OC_NEWARK: unknown
F1 = misc:MC36207
F2 F3 = fuse:19560: FUSE HOLDER TR5, Wickmann; MPN: 56000001009; OC_FARNELL: 1185363; OC_NEWARK: 15P8392
IC1 = we-power:LDO: LDOs TS1117 800mA max 15V - compatible NCP1117 1A max 20V TS9011 250mA max 12V - compatible AP2210 300mA max 15V TS5204 150mA max 16V
IC2 = misc:ATSAM4S8C
IC3 = misc:SI87XX
IC4 = misc:74HC125
IC5 = 74xx-us:74*08: Quad 2-input AND gate
IC6-IC10 = SilentStepStick-TMC2130_v11:TMC21X0: Trinamic TMC21x0 Stepper Motor Driver (5V...46V, 1.2A RMS, 256 microsteps) TMC2100 - CFG pins for configuration (standalone) TMC2130 - SPI for configuration
IC11 = 74xx-us:74*32: Quad 2-input OR gate
J1 = misc:MOLEX-105162-001
J2 = con-phoenix-508:MSTBV4: PHOENIX; MPN: MSTBV 2,5/4-GF-5.08; OC_FARNELL: 1792794; OC_NEWARK: 69R9847
L1 L3 = Arduino:INDUCTOR: Inductors
L2 = Arduino-DUE-V03:L-US: INDUCTOR, American symbol
L4-L6 = Zero_V1.0:INDUCTOR: Inductors
PWRIN = con-phoenix-508:MSTBA2: PHOENIX; MF: FARNELL; MPN: 1757242; OC_FARNELL: 3705171; OC_NEWARK: 71C4161
Q1 Q2 = misc:NX138BKS
Q3 Q4 = misc:BUK9Y53-100B: N-channel TrenchMOS logic level FET
R1-R51 R53-R55 R57-R59 R61-R63 R65-R67 R69 = resistor:R-US_: RESISTOR, American symbol
R52 R56 R60 R64 R68 = resistor:R-TRIMM: Trimm resistor
RESET = misc:EVQQ2
SJ1 SJ2 = jumper:SJ: SMD solder JUMPER
U1 = misc:A4403
X1 = SmartPrj:PN61729: BERG USB connector
X2 = misc:CRYSTAL-4PIN
X4-X9 = con-other:KK-254-4
X_STOP Y_STOP Z_STOP = con-other:KK-254-3

## Net classes
3 usbvcc: width 0.102 mm, drill 0.1 mm, clearance 0.15 mm
4 diff: width 0.203 mm